# EAGLE design LEDStripCombiner (EAGLE 8.0.2)
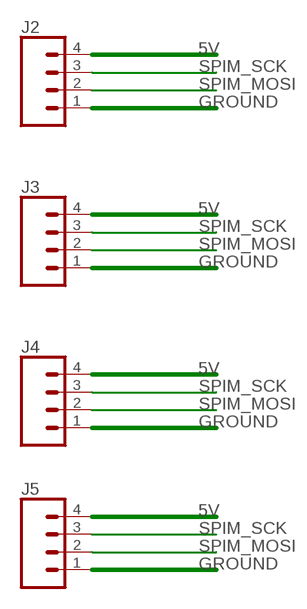
[diagram p0: schematic, sheet 1]

## Parts
J2  CONN_041X04_NO_SILK  [1X04_NO_SILK]
J3  CONN_041X04_NO_SILK  [1X04_NO_SILK]
J4  CONN_041X04_NO_SILK  [1X04_NO_SILK]
J5  CONN_041X04_NO_SILK  [1X04_NO_SILK]

## Nets
5V: J2.4 J3.4 J4.4 J5.4
GROUND: J2.1 J3.1 J4.1 J5.1
SPIM_MOSI: J2.2 J3.2 J4.2 J5.2
SPIM_SCK: J2.3 J3.3 J4.3 J5.3

## Library data of the parts
J2-J5 = SparkFun-Connectors:CONN_04: Multi connection point. Often used as Generic Header-pin footprint for 0.1 inch spaced/style header connections On any of the 0.1 inch spaced packages, you can populate with these: Break Away Headers - Straight <https://www.sparkfun.com/products/116> (PRT-00116) Break Away Male Headers - Right Angle <https://www.sparkfun.com/products/553> (PRT-00553) Female Headers <https://www.sparkfun.com/products/115> (PRT-00115) Break Away Headers - Machine Pin <https://www.sparkfun.com/products/117> (PRT-00117) Break Away Female Headers - Swiss Machine Pin <https://www.sparkfun.com/products/743> (PRT-00743) For SCREWTERMINALS and SPRING TERMINALS visit here: Screw Terimnals on SparkFun.com <https://www.sparkfun.com/search/results?term=Screw+Terminals> (5mm/3.5mm/2.54mm spacing) This device is also useful as a general connection point to wire up your design to another part of your project. Our various solder wires solder well into these plated through hole pads. Hook-Up Wire - Assortment (Stranded, 22 AWG) <https://www.sparkfun.com/products/11375> (PRT-11375) Hook-Up Wire - Assortment (Solid Core, 22 AWG) <https://www.sparkfun.com/products/11367> (PRT-11367) View the entire wire category on our website here <https://www.sparkfun.com/categories/141> Special notes: Molex polarized connector foot print use with SKU : PRT-08231 with associated crimp pins and housings. 1MM SMD Version SKU: PRT-10208; PROD_ID: CONN-09696

## Net classes
0 default: width 0.15 mm, drill 0.3 mm, clearance 0.15 mm

## Board
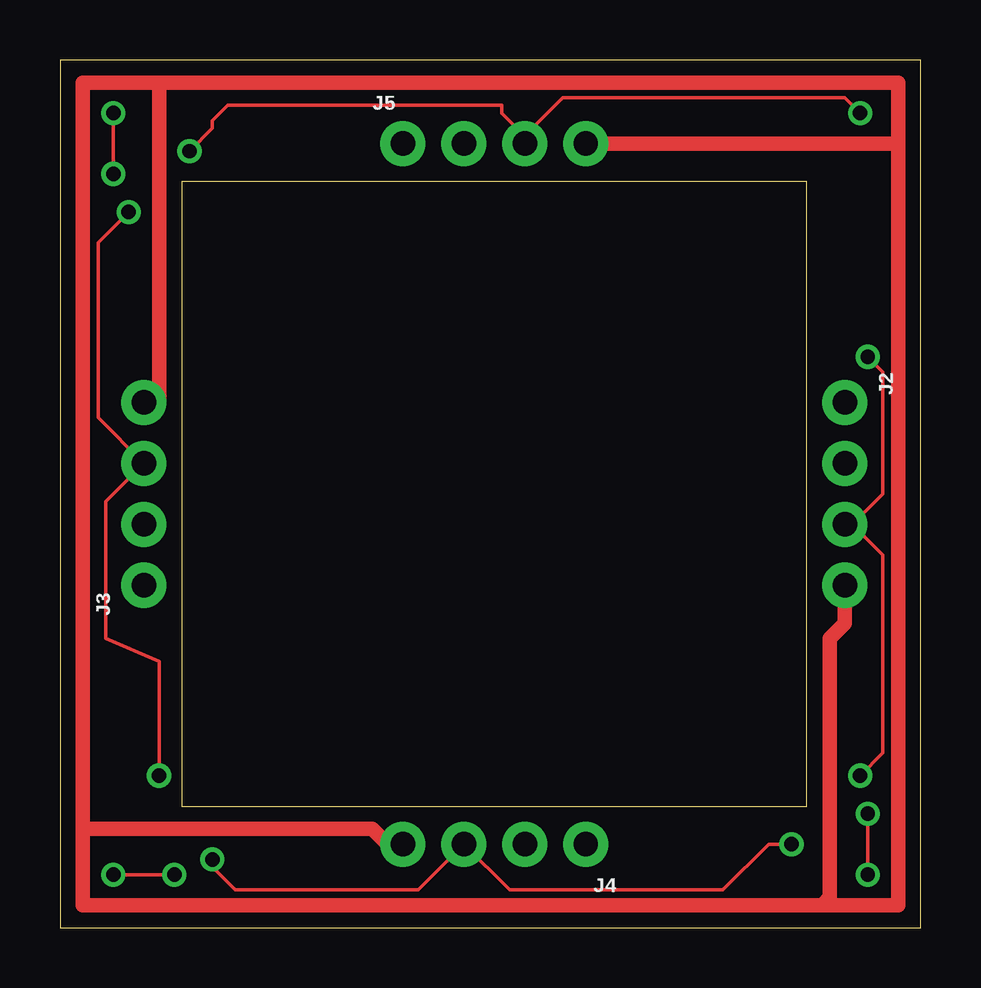
[diagram p1: board, top side]
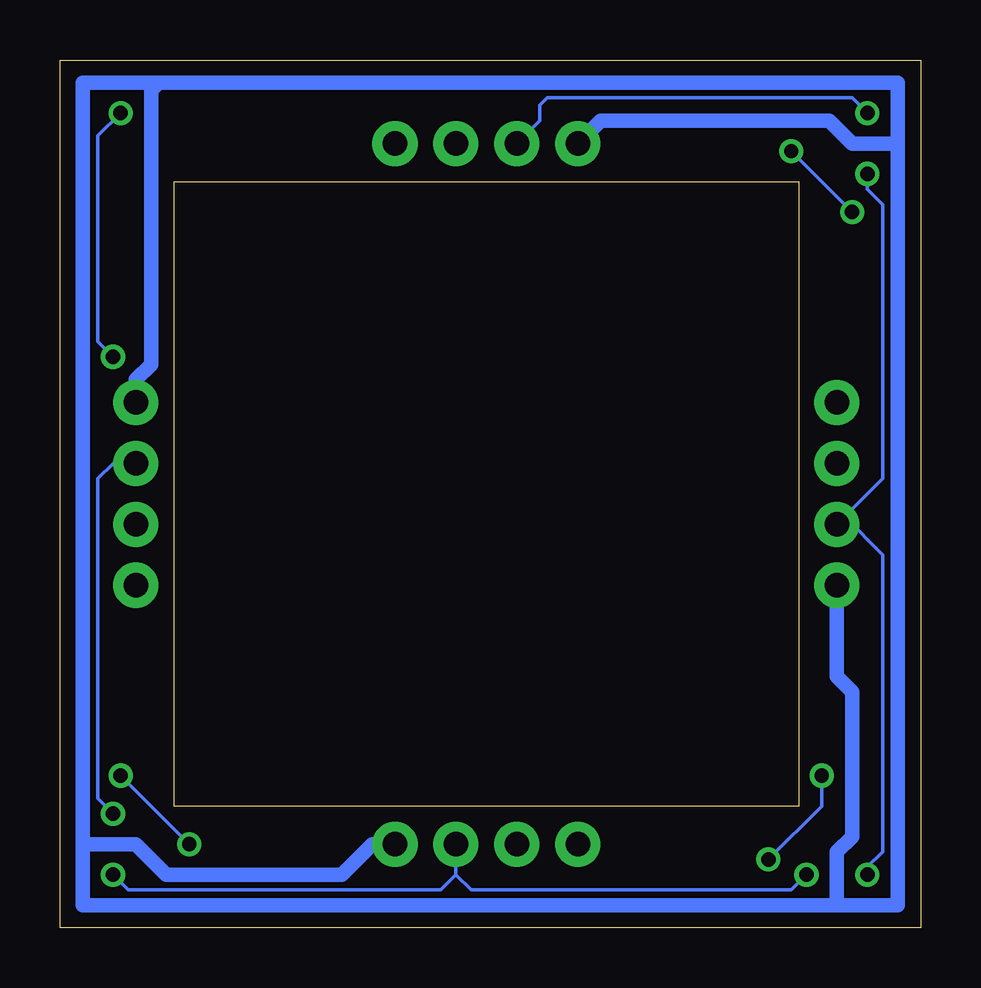
[diagram p2: board, bottom side, seen from below]

Size 35.87 x 36.19 mm. Coordinates in mm from the lower left corner, seen from the top.
Outline: 0,0 35.87,0 35.87,36.19 0,36.19 0,0
Copper layers (1*16): Top 0.035mm / dielectric 1.5mm / Bottom 0.035mm
Design rules "default *": minimum track width 6mil, minimum drill 12mil, track to track 6mil, track to pad 6mil, pad to pad 6mil, via to via 6mil, smd to smd 8mil, copper to edge 20mil, drill to drill 8mil, minimum pad ring 10mil, minimum via ring 8mil, stop-mask expansion 4mil, vias tented up to drill 0mil, thermal gap 10mil
Milling: 4 lines

### Footprints (pad centres in the part's own frame; a part is rotated, then mirrored left to right if it is on the bottom)
1X04_NO_SILK = drill 1.016 pad 1.88: 1 0,0; 2 2.54,0; 3 5.08,0; 4 7.62,0

### Placement (x,y rotation side)
J2  32.7,21.91 270 top
J3  3.49,14.29 90 top
J4  21.91,3.49 180 top
J5  14.29,32.7 0 top

### Tracks (layer width: path | path; a pad name or v marks a point on that pad's centre or on a via)
5V
  Top 0.61: J5.4 34.92,32.7 | 34.92,32.7 34.92,0.95 31.75,0.95 | 31.75,0.95 0.95,0.95 0.95,4.13 | 4.13,35.24 0.95,35.24 0.95,4.13 | 4.13,35.24 34.92,35.24 34.92,32.7 | J3.4 4.13,21.91 4.13,35.24 | J2.4 32.7,12.7 32.07,12.06 32.07,1.27 31.75,0.95 | J4.4 13.65,3.49 13.02,4.13 0.95,4.13
GROUND
  Bottom 0.61: 0.95,32.7 0.95,35.24 31.75,35.24 | 0.95,32.7 0.95,0.95 3.49,0.95 | 3.49,13.97 J3.1 3.49,10.48 2.86,9.84 2.86,3.81 3.49,3.17 3.49,0.95 | 31.75,35.24 34.92,35.24 34.92,3.49 | 3.49,0.95 34.92,0.95 34.92,3.49 | J5.1 13.34,33.66 3.81,33.66 2.86,32.7 0.95,32.7 | J2.1 32.7,22.86 32.07,23.5 32.07,34.92 31.75,35.24 | J4.1 22.86,3.49 24.13,2.22 31.43,2.22 32.7,3.49 34.92,3.49
N$1  (via drill 0.6)
  Top 0.152: v6.35,2.86 6.35,2.54 7.3,1.59 14.92,1.59 16.83,3.49
N$2  (via drill 0.6)
  Top 0.152: v4.13,6.35 4.13,11.11 1.91,12.06 1.91,17.78 3.49,19.37
  Bottom 0.152: v4.13,6.35 4.13,5.08 6.35,2.86
SPIM_MOSI  (via drill 0.6)
  Top 0.152: v2.22,31.43 v2.22,33.97 | v2.22,2.22 v4.76,2.22 | v33.66,2.22 v33.66,4.76
  Bottom 0.152: J5.2 15.88,33.66 15.88,34.29 15.56,34.61 2.86,34.61 v2.22,33.97 | v4.76,2.22 5.4,1.59 18.73,1.59 19.37,2.22 | 19.37,2.22 J4.2 | v33.66,2.22 33.02,1.59 20,1.59 19.37,2.22 | v33.66,4.76 34.29,5.4 34.29,18.73 33.66,19.37 J2.2 | v2.22,31.43 2.22,30.8 1.59,30.16 1.59,18.73 3.17,17.14 | 3.17,17.14 1.59,15.56 1.59,3.17 2.22,2.54 v2.22,2.22 | 3.17,17.14 J3.2
SPIM_SCK  (via drill 0.6)
  Top 0.152: 19.37,33.02 18.41,33.97 18.41,34.29 6.99,34.29 6.35,33.66 6.35,33.34 v5.4,32.38 | 3.17,29.84 v2.86,29.84 1.59,28.57 1.59,21.27 J3.3 | 33.02,16.83 34.29,18.1 34.29,23.18 v33.66,23.81 | 19.37,33.02 20.95,34.61 32.7,34.61 v33.34,33.97 | 19.37,33.02 J5.3 | 33.02,16.83 34.29,15.56 34.29,7.3 v33.34,6.35 | 33.02,16.83 J2.3 | v30.48,3.49 29.53,3.49 27.62,1.59 18.73,1.59 J4.3 | 14.92,1.59 J4.3 | 14.92,1.59 8.89,1.59 | J4.3 14.92,1.59
  Bottom 0.152: v5.4,32.38 v2.86,29.84 | v33.34,33.97 34.29,33.02 34.29,24.45 v33.66,23.81 | v33.34,6.35 v30.48,3.49